# Altium schematic sheet MCU_PWR.SchDoc: MCU PWR
size A4; Date: Not used; ApprovedBy: Not used; CheckedBy: Not used; Author: Not used; CompanyName: STMicroelectronics; DrawnBy: Not used; Engineer: Not used; Organization: Not used; Address1: Not used; Address2: Not used; Address3: Not used; Address4: Not used; DocumentNumber: Not used; Revision: Not used; SheetNumber: 5; SheetTotal: 16; CurrentTime: Not used; CurrentDate: Not used; Time: Not used; DocumentFullPathAndName: Not used; DocumentName: Not used; ModifiedDate: Not used; ImagePath: Not used; ProjectName: Not used; Application_BuildNumber: Not used
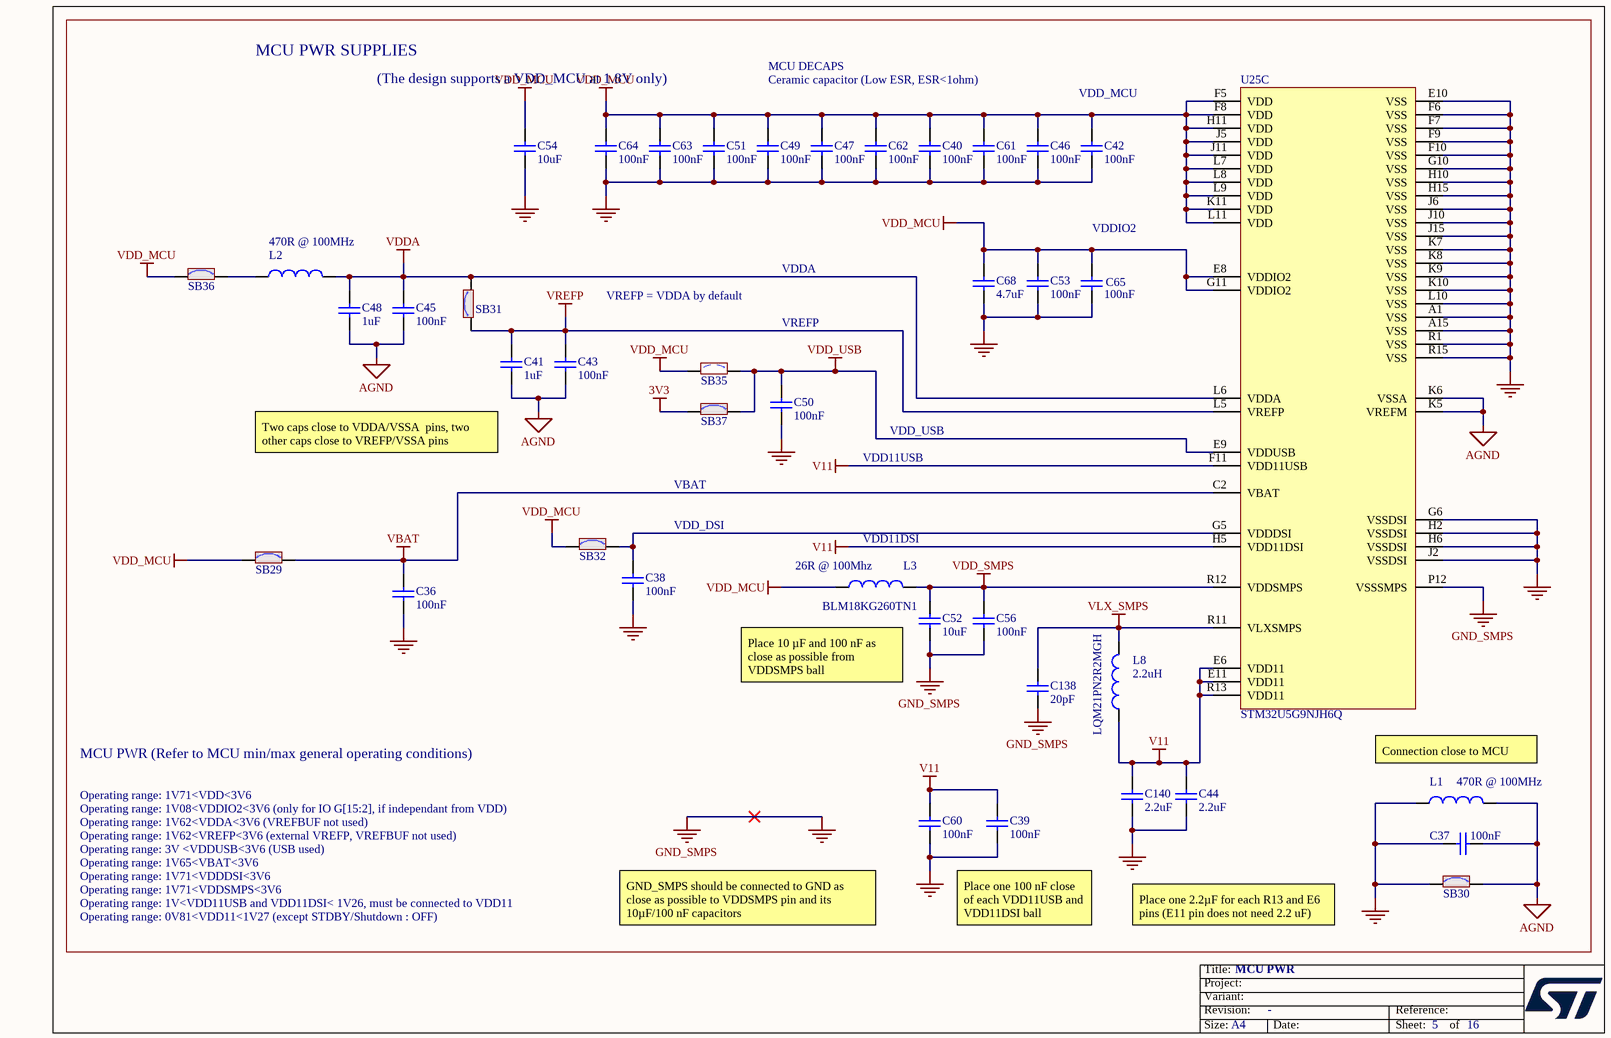
[diagram p0: MCU_PWR.SchDoc]

## Parts
C36  value 100nF  [C0402]  (hidden comment: Capacitor)
C37  value 100nF  [C0402]  (hidden comment: Capacitor)
C38  value 100nF  [C0402]  (hidden comment: Capacitor)
C39  value 100nF  [C0402]  (hidden comment: Capacitor)
C40  value 100nF  [C0402]  (hidden comment: Capacitor)
C41  value 1uF  [C0402]  (hidden comment: Capacitor)
C42  value 100nF  [C0402]  (hidden comment: Capacitor)
C43  value 100nF  [C0402]  (hidden comment: Capacitor)
C44  value 2.2uF  [C0402]  (hidden comment: Capacitor)
C45  value 100nF  [C0402]  (hidden comment: Capacitor)
C46  value 100nF  [C0402]  (hidden comment: Capacitor)
C47  value 100nF  [C0402]  (hidden comment: Capacitor)
C48  value 1uF  [C0402]  (hidden comment: Capacitor)
C49  value 100nF  [C0402]  (hidden comment: Capacitor)
C50  value 100nF  [C0402]  (hidden comment: Capacitor)
C51  value 100nF  [C0402]  (hidden comment: Capacitor)
C52  value 10uF  [C0603_H0P8]  (hidden comment: Capacitor)
C53  value 100nF  [C0402]  (hidden comment: Capacitor)
C54  value 10uF  [C0402]  (hidden comment: Capacitor)
C56  value 100nF  [C0402]  (hidden comment: Capacitor)
C60  value 100nF  [C0402]  (hidden comment: Capacitor)
C61  value 100nF  [C0402]  (hidden comment: Capacitor)
C62  value 100nF  [C0402]  (hidden comment: Capacitor)
C63  value 100nF  [C0402]  (hidden comment: Capacitor)
C64  value 100nF  [C0402]  (hidden comment: Capacitor)
C65  value 100nF  [C0402]  (hidden comment: Capacitor)
C68  value 4.7uF  [C0402]  (hidden comment: Capacitor)
C138  value 20pF  [C0402]  (hidden comment: Capacitor)
C140  value 2.2uF  [C0402]  (hidden comment: Capacitor)
L1  value 470R @ 100MHz  [IND_0402_MURATA_BLM15H_H0P5]  (hidden comment: Inductor)
L2  value 470R @ 100MHz  [IND_0402_MURATA_BLM15H_H0P5]  (hidden comment: Inductor)
L3  value 26R @ 100Mhz  Manufacturer_Part_Number: BLM18KG260TN1  [FIL_0603_H0P65]  (hidden comment: BEAD)
L8  value 2.2uH  Manufacturer_Part_Number: LQM21PN2R2MGH  [L0805_H0P9]  (hidden comment: Inductor)
SB29  SB_ON  [SOLDER-BRIDGE_R0402-0R]  (value not drawn)
SB30  SB_ON  [SOLDER-BRIDGE_R0402-0R]  (value not drawn)
SB31  SB_ON  [SOLDER-BRIDGE_R0402-0R]  (value not drawn)
SB32  SB_ON  [SOLDER-BRIDGE_R0402-0R]  (value not drawn)
SB35  SB_OFF  [SOLDER-BRIDGE_R0402-0R]  (value not drawn)
SB36  SB_ON  [SOLDER-BRIDGE_R0402-0R]  (value not drawn)
SB37  SB_ON  [SOLDER-BRIDGE_R0402-0R]  (value not drawn)
U25  value STM32U5G9NJH6Q  [ICC_TFBGA216_13X13_P080_H1P10_CODE-A0L2]  (hidden comment: STM32U599NJH6Q_BGA216_SMPS)  (part C of 3)

## Nets
3V3: SB37.1
AGND: C37.2 C41.1 C43.1 C45.1 C48.1 L1.2 SB30.2 U25.K5(VREFM) U25.K6(VSSA)
GND: C36.1 C37.1 C38.1 C39.1 C40.1 C42.1 C44.1 C46.1 C47.1 C49.1 C50.1 C51.1 C52.1 C53.1 C54.1 C56.1 C60.1 C61.1 C62.1 C63.1 C64.1 C65.1 C68.1 C138.1 C140.1 L1.1 SB30.1 U25.A1(VSS) U25.A15(VSS) U25.E10(VSS) U25.F6(VSS) U25.F7(VSS) U25.F9(VSS) U25.F10(VSS) U25.G6(VSSDSI) U25.G10(VSS) U25.H2(VSSDSI) U25.H6(VSSDSI) U25.H10(VSS) U25.H15(VSS) U25.J2(VSSDSI) U25.J6(VSS) U25.J10(VSS) U25.J15(VSS) U25.K7(VSS) U25.K8(VSS) U25.K9(VSS) U25.K10(VSS) U25.L10(VSS) U25.P12(VSSSMPS) U25.R1(VSS) U25.R15(VSS)  [also labelled GND_SMPS]
V11: C39.2 C44.2 C60.2 C140.2 L8.1 U25.E6(VDD11) U25.E11(VDD11) U25.F11(VDD11USB) U25.H5(VDD11DSI) U25.R13(VDD11)
VBAT: C36.2 SB29.2 U25.C2(VBAT)
VDD_MCU: C40.2 C42.2 C46.2 C47.2 C49.2 C51.2 C53.2 C54.2 C61.2 C62.2 C63.2 C64.2 C65.2 C68.2 L3.1 SB29.1 SB32.1 SB35.1 SB36.1 U25.E8(VDDIO2) U25.F5(VDD) U25.F8(VDD) U25.G11(VDDIO2) U25.H11(VDD) U25.J5(VDD) U25.J11(VDD) U25.K11(VDD) U25.L7(VDD) U25.L8(VDD) U25.L9(VDD) U25.L11(VDD)
VDD_SMPS: C52.2 C56.2 L3.2 U25.R12(VDDSMPS)
VDD_USB: C50.2 SB35.2 SB37.2 U25.E9(VDDUSB)
VDDA: C45.2 C48.2 L2.2 SB31.2 U25.L6(VDDA)
VLX_SMPS: C138.2 L8.2 U25.R11(VLXSMPS)
VREFP: C41.2 C43.2 SB31.1 U25.L5(VREFP)
NetC38_2: C38.2 SB32.2 U25.G5(VDDDSI)
NetL2_1: L2.1 SB36.2

## Notes on the sheet
- MCU PWR SUPPLIES
- (The design supports a VDD_MCU at 1.8V only)
- MCU DECAPS
- Ceramic capacitor (Low ESR, ESR<1ohm)
- VDD_MCU
- (near C65) VDDIO2
- VREFP = VDDA by default
- VDDA
- VREFP
- (near C41) Two caps close to VDDA/VSSA  pins, two other caps close to VREFP/VSSA pins
- VDD_USB
- VBAT
- VDD11USB
- VDD_DSI
- (near L3) VDD11DSI
- Place 10 µF and 100 nF as close as possible from VDDSMPS ball
- MCU PWR (Refer to MCU min/max general operating conditions)
- Connection close to MCU
- Operating range: 1V71<VDD<3V6
- Operating range: 1V08<VDDIO2<3V6 (only for IO G[15:2], if independant from VDD)
- Operating range: 1V62<VDDA<3V6 (VREFBUF not used)
- Operating range: 3V <VDDUSB<3V6 (USB used)
- Operating range: 1V62<VREFP<3V6 (external VREFP, VREFBUF not used)
- Operating range: 1V65<VBAT<3V6
- Operating range: 1V71<VDDSMPS<3V6
- Operating range: 1V71<VDDDSI<3V6
- Operating range: 1V<VDD11USB and VDD11DSI< 1V26, must be connected to VDD11
- Operating range: 0V81<VDD11<1V27 (except STDBY/Shutdown : OFF)
- GND_SMPS should be connected to GND as close as possible to VDDSMPS pin and its 10µF/100 nF capacitors
- Place one 100 nF close of each VDD11USB and VDD11DSI ball
- Place one 2.2µF for each R13 and E6 pins (E11 pin does not need 2.2 uF)
- Title:
- Project:
- Size:
- Revision:
- Variant:
- A4
- -
- Date:
- Reference:
- Sheet:
- of

## Library data of the parts
C36-C40 C42 C43 C45-C47 C49-C51 C53 C56 C60-C65 = MCD-00006: Capacitor, MLCC, 100nF, 16V, X7R, +/-10%, 0402, T=0.5mm; Manufacturer_Part_Number: CC0402KRX7R7BB104; Manufacturer: YAGEO; Part_Preference: Recommended; Order_Code_RS: 616-9701; Component_Country_Of_Origin: China; Internal_Part_Number: MCD-00006; Status: Released; Part_Type: Capacitor; Package: 0402; ComponentLink1URL: http://tunmcdsvn.tun.st.com/Component_Documentation_Library/Trunk/Capacitor/YAGEO_X7R_Series; Order_Code_Digikey: 311-1338-1-ND; Order_Code_Farnell: 9402047
C41 C48 = MCD-01722: Capacitor, MLCC, 1uF, 10V, X5R, +/-10%, 0402, T=0.5mm; Manufacturer_Part_Number: CC0402KRX5R6BB105; Manufacturer: YAGEO; Part_Preference: Recommended; Component_Country_Of_Origin: China; Internal_Part_Number: MCD-01722; Status: Released; Part_Type: Capacitor; Package: 0402; ComponentLink1URL: http://tunmcdsvn.tun.st.com/Component_Documentation_Library/Trunk/Capacitor/YAGEO_X5R_Series; Order_Code_Digikey: 311-1439-1-ND; Order_Code_Farnell: 1458896; Order_Code_RS: N/A
C44 C140 = MCD-02606: Capacitor, MLCC, 2.2uF, 6.3V, X5R, +/-10%, 0402, T=0.5mm; Part_Preference: Recommended; Manufacturer: YAGEO; Manufacturer_Part_Number: CC0402KRX5R5BB225; Order_Code_RS: 1992205; Internal_Part_Number: MCD-02606; Status: New; Part_Type: Capacitor; Package: 0402; ComponentLink1URL: http://tunmcdsvn.tun.st.com/Component_Documentation_Library/Trunk/Capacitor/YAGEO_X5R_Series; Order_Code_Digikey: 311-1682-2-ND; Order_Code_Farnell: 3366429
C52 = MCD-02605: Capacitor, MLCC, 10uF, 10V, X5R, +/-10%, 0603, T=0.8mm; Part_Preference: Recommended; Manufacturer: YAGEO; Manufacturer_Part_Number: CC0603KRX5R6BB106; Order_Code_RS: 2006536; Internal_Part_Number: MCD-02605; Status: Checked; Part_Type: Capacitor; Package: 0603; ComponentLink1URL: http://tunmcdsvn.tun.st.com/Component_Documentation_Library/Trunk/Capacitor/YAGEO_X5R_Series; Order_Code_Digikey: 311-1782-2-ND; Order_Code_Farnell: 3759761
C54 = MCD-01716: Capacitor, MLCC, 10uF, 6V3, X5R, +/-20%, 0402, T=0.5mm; Part_Preference: Recommended; Manufacturer: YAGEO; Manufacturer_Part_Number: CC0402MRX5R5BB106; Component_Country_Of_Origin: China; Internal_Part_Number: MCD-01716; Status: Released; Part_Type: Capacitor; Package: 0402; ComponentLink1URL: http://tunmcdsvn.tun.st.com/Component_Documentation_Library/Trunk/Capacitor/YAGEO_X5R_Series; Order_Code_Digikey: 311-1729-1-ND; Order_Code_Farnell: N/A; Order_Code_RS: N/A
C68 = MCD-02608: Capacitor, MLCC, 4.7uF, 6.3V, X5R, +/-10%, 0402, T=0.5mm; Part_Preference: Recommended; Manufacturer: YAGEO; Manufacturer_Part_Number: CC0402KRX5R5BB475; Internal_Part_Number: MCD-02608; Status: New; Part_Type: Capacitor; Package: 0402; ComponentLink1URL: http://tunmcdsvn.tun.st.com/Component_Documentation_Library/Trunk/Capacitor/YAGEO_X5R_Series; Order_Code_Digikey: 311-3476-2-ND; Order_Code_Farnell: 3366432; Order_Code_RS: N/A
C138 = MCD-00016: Capacitor, MLCC, 20pF, 50V, NPO, +/- 5%, 0402, T=0.5mm; Manufacturer: YAGEO; Manufacturer_Part_Number: CC0402JRNPO9BN200; Part_Preference: Recommended; Component_Country_Of_Origin: China; Internal_Part_Number: MCD-00016; Status: Released; Part_Type: Capacitor; Package: 0402; ComponentLink1URL: http://tunmcdsvn.tun.st.com/Component_Documentation_Library/Trunk/Capacitor/YAGEO_NP0_Series; Order_Code_Digikey: 311-1417-1-ND; Order_Code_Farnell: N/A; Order_Code_RS: N/A
L1 L2 = MCD-01986: Ferrite bead, 470R @ 100MHz, +/-25%, 200mA, 0R6, 0402, T=0.55mm; Manufacturer_Part_Number: BLM15BD471SN1D; Manufacturer: MURATA; Part_Preference: Recommended; Order_Code_RS: 166-9836; Component_Country_Of_Origin: Japan; Internal_Part_Number: MCD-01986; Status: Released; Part_Type: Inductor; Package: 0402; ComponentLink1URL: http://tunmcdsvn.tun.st.com/Component_Documentation_Library/Trunk/Inductor/MURATA_BLM_Series; Order_Code_Digikey: 490-5194-1-ND; Order_Code_Farnell: 1515776
L3 = MCD-00305: Ferrite bead, 26R @ 100Mhz, +/-25%, 6000mA, 0R007, 0603, T=0.75mm; Part_Type: Inductor; Manufacturer: MURATA; Part_Preference: Recommended; Order_Code_RS: 747-4723; Component_Country_Of_Origin: Japan; Internal_Part_Number: MCD-00305; Status: Checked; ComponentLink1URL: http://tunmcdsvn.tun.st.com/Component_Documentation_Library/Trunk/Inductor/MURATA_BLM_Series; Package: 0603; Order_Code_Digikey: 490-5252-2-ND; Order_Code_Farnell: 1781087
L8 = MCD-01060: Inductor, 2.2uH, +/-20%, 0.7A, 0R156, 0805, T=0.9mm; Manufacturer: MURATA; Part_Preference: Recommended; Order_Code_RS: 166-9883; Component_Country_Of_Origin: Japan; Internal_Part_Number: MCD-01060; Status: Released; Part_Type: Inductor; Package: 0805; ComponentLink1URL: http://tunmcdsvn.tun.st.com/Component_Documentation_Library/Trunk/Inductor/MURATA_LQM_Series; Order_Code_Digikey: 490-9573-2-ND; Order_Code_Farnell: 3471402
SB29-SB32 SB36 SB37 = MCD-01618: Solder Bridge 0402 ON; Part_Type: Misc; Manufacturer_Part_Number: RC0402JR-070RL; Manufacturer: YAGEO; Part_Preference: Recommended; Order_Code_RS: 618-5804; Component_Country_Of_Origin: China; Internal_Part_Number: MCD-01618; Status: Released; Package: SB0402; ComponentLink1URL: http://tunmcdsvn.tun.st.com/Component_Datasheet_Library/Trunk/Resistors/Yageo_Resistor_RC0402-series; Order_Code_Digikey: 311-0.0JRTR-ND; Order_Code_Farnell: 2363467
SB35 = MCD-02162: Solder Bridge 0402 OFF; Part_Type: Misc; Manufacturer_Part_Number: RC0402JR-070RL; Manufacturer: YAGEO; Part_Preference: Recommended; Order_Code_RS: 618-5804; Component_Country_Of_Origin: China; Internal_Part_Number: MCD-02162; Status: Checked; Package: SB0402; ComponentLink1URL: http://tunmcdsvn.tun.st.com/Component_Datasheet_Library/Trunk/Resistors/Yageo_Resistor_RC0402-series; Order_Code_Digikey: 311-0.0JRTR-ND; Order_Code_Farnell: 2363467
U25 = MCD-03271: MCU, ARM Cortex-M33, 4MB Flash, 3MB RAM, With Crypto; Part_Type: IC; Part_Preference: Recommended; Manufacturer: STMICROELECTRONICS; Component_Country_Of_Origin: Unknown; ShowFields: YES; ID: 5387; Internal_Part_Number: MCD-03271; Status: Released; Manufacturer_Part_Number: STM32U5G9NJH6Q; Package: TFBGA216; ComponentLink1URL: http://tunmcdsvn.tun.st.com/Component_Documentation_Library/Trunk/IC/STMICROELECTRONICS_STM32U5G9NJH6Q; Order_Code_Digikey: N/A; Order_Code_Farnell: N/A; Order_Code_RS: N/A